# Altium schematic sheet RAM.schdoc
size 272 x 191 mm
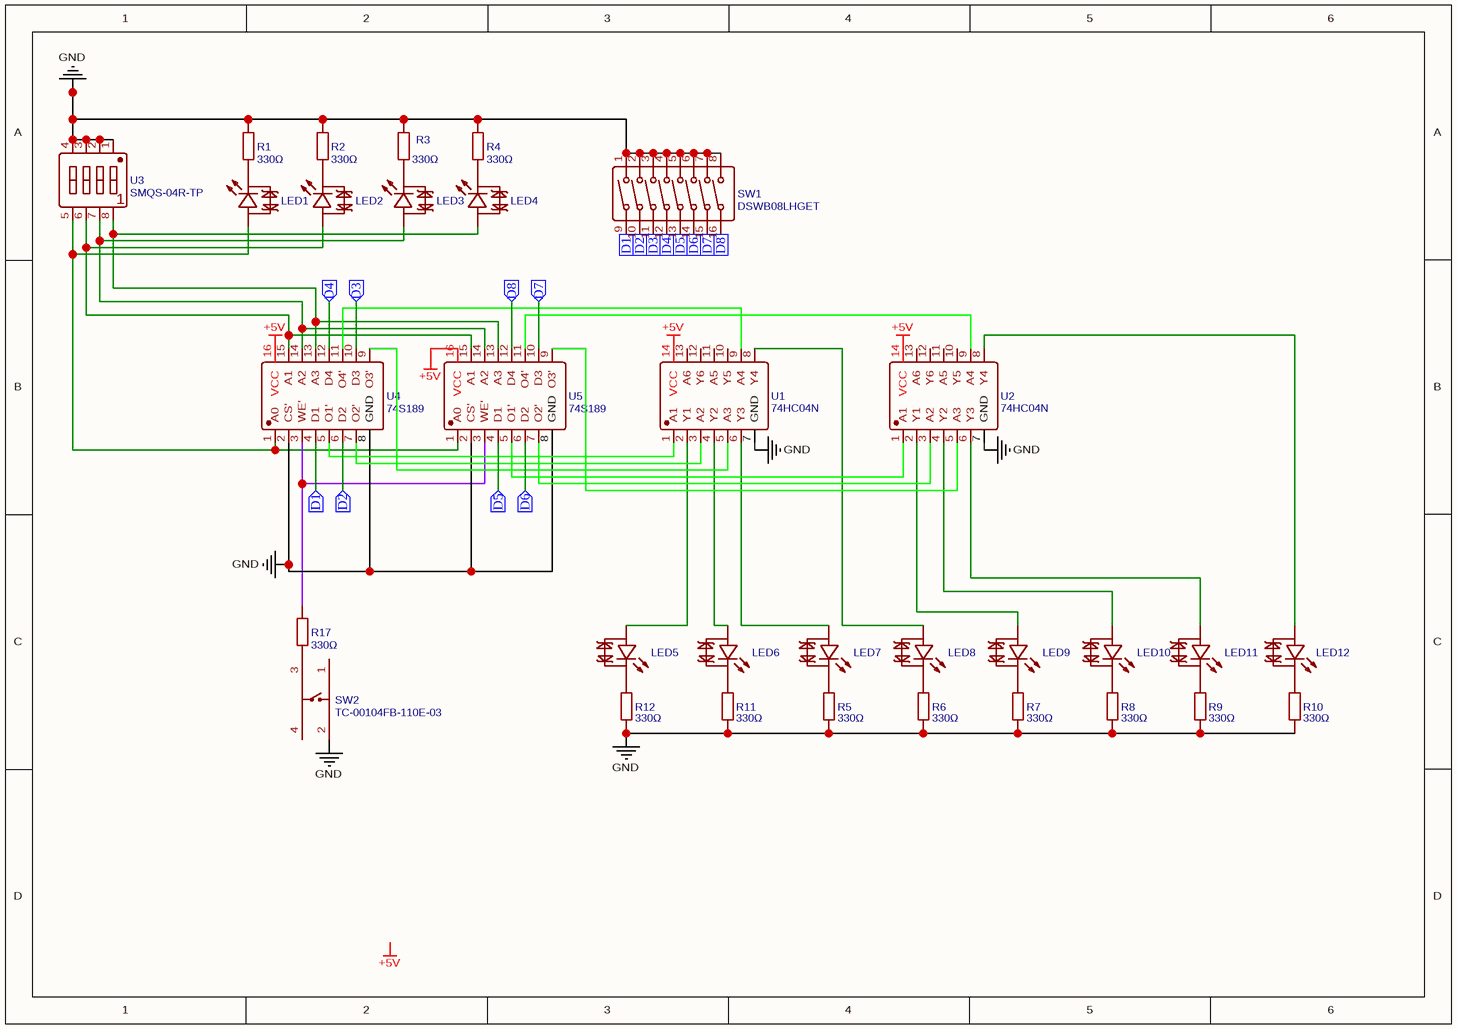
[diagram p0: RAM.schdoc]

## Parts
LED1  204-15UTC/S400-X9-L  [LED-TH_BD3.0-P2.54-FD]  (value not drawn)
LED2  204-15UTC/S400-X9-L  [LED-TH_BD3.0-P2.54-FD]  (value not drawn)
LED3  204-15UTC/S400-X9-L  [LED-TH_BD3.0-P2.54-FD]  (value not drawn)
LED4  204-15UTC/S400-X9-L  [LED-TH_BD3.0-P2.54-FD]  (value not drawn)
LED5  204-15UTC/S400-X9-L  [LED-TH_BD3.0-P2.54-FD]  (value not drawn)
LED6  204-15UTC/S400-X9-L  [LED-TH_BD3.0-P2.54-FD]  (value not drawn)
LED7  204-15UTC/S400-X9-L  [LED-TH_BD3.0-P2.54-FD]  (value not drawn)
LED8  204-15UTC/S400-X9-L  [LED-TH_BD3.0-P2.54-FD]  (value not drawn)
LED9  204-15UTC/S400-X9-L  [LED-TH_BD3.0-P2.54-FD]  (value not drawn)
LED10  204-15UTC/S400-X9-L  [LED-TH_BD3.0-P2.54-FD]  (value not drawn)
LED11  204-15UTC/S400-X9-L  [LED-TH_BD3.0-P2.54-FD]  (value not drawn)
LED12  204-15UTC/S400-X9-L  [LED-TH_BD3.0-P2.54-FD]  (value not drawn)
R1  330Ω  [RES-TH_BD3.3-L9.0-P13.00-D0.6]
R2  330Ω  [RES-TH_BD3.3-L9.0-P13.00-D0.6]
R3  330Ω  [RES-TH_BD3.3-L9.0-P13.00-D0.6]
R4  330Ω  [RES-TH_BD3.3-L9.0-P13.00-D0.6]
R5  330Ω  [RES-TH_BD3.3-L9.0-P13.00-D0.6]
R6  330Ω  [RES-TH_BD3.3-L9.0-P13.00-D0.6]
R7  330Ω  [RES-TH_BD3.3-L9.0-P13.00-D0.6]
R8  330Ω  [RES-TH_BD3.3-L9.0-P13.00-D0.6]
R9  330Ω  [RES-TH_BD3.3-L9.0-P13.00-D0.6]
R10  330Ω  [RES-TH_BD3.3-L9.0-P13.00-D0.6]
R11  330Ω  [RES-TH_BD3.3-L9.0-P13.00-D0.6]
R12  330Ω  [RES-TH_BD3.3-L9.0-P13.00-D0.6]
R17  330Ω  [RES-TH_BD3.3-L9.0-P13.00-D0.6]
SW1  DSWB08LHGET  [SW-TH_DSWB08LHGET]
SW2  TC-00104FB-110E-03  [SW-TH_4P-L6.0-W6.0-P4.50-LS6.5]
U1  74HC04N  [DIP-14_L19.4-W6.4-P2.54-LS7.6-BL]
U2  74HC04N  [DIP-14_L19.4-W6.4-P2.54-LS7.6-BL]
U3  SMQS-04R-TP  [SW-TH_8P-P2.54_SMQS-04R-TP]
U4  74S189  [SOP-8]
U5  74S189  [SOP-8]

## Ports
D1 (in), D2 (in), D3 (in), D4 (in), D5 (in), D6 (in), D7 (in), D8 (in)

## Nets
+5V: U1.14(VCC) U2.14(VCC) U4.16(VCC) U5.16(VCC)
GND: R1.2 R2.2 R3.2 R4.2 R5.2 R6.2 R7.2 R8.2 R9.2 R10.2 R11.2 R12.2 SW1.1 SW1.2 SW1.3 SW1.4 SW1.5 SW1.6 SW1.7 SW1.8 SW2.2 U1.7(GND) U2.7(GND) U3.1(PIN1) U3.2(PIN2) U3.3(PIN3) U3.4(PIN4) U4.2(CS') U4.8(GND) U5.2(CS') U5.8(GND)
D1: SW1.9 U4.4(D1) ; port D1
D2: SW1.10 U4.6(D2) ; port D2
D3: SW1.11 U4.10(D3) ; port D3
D4: SW1.12 U4.12(D4) ; port D4
D5: SW1.13 U5.4(D1) ; port D5
D6: SW1.14 U5.6(D2) ; port D6
D7: SW1.15 U5.10(D3) ; port D7
D8: SW1.16 U5.12(D4) ; port D8
NetLED1_1: LED1.1(A) U3.5(PIN5) U4.1(A0) U5.1(A0)
NetLED1_2: LED1.2(C) R1.1
NetLED2_1: LED2.1(A) U3.6(PIN6) U4.15(A1) U5.15(A1)
NetLED2_2: LED2.2(C) R2.1
NetLED3_1: LED3.1(A) U3.7(PIN7) U4.14(A2) U5.14(A2)
NetLED3_2: LED3.2(C) R3.1
NetLED4_1: LED4.1(A) U3.8(PIN8) U4.13(A3) U5.13(A3)
NetLED4_2: LED4.2(C) R4.1
NetLED5_1: LED5.1(A) U1.2(Y1)
NetLED5_2: LED5.2(C) R12.1
NetLED6_1: LED6.1(A) U1.4(Y2)
NetLED6_2: LED6.2(C) R11.1
NetLED7_1: LED7.1(A) U1.6(Y3)
NetLED7_2: LED7.2(C) R5.1
NetLED8_1: LED8.1(A) U1.8(Y4)
NetLED8_2: LED8.2(C) R6.1
NetLED9_1: LED9.1(A) U2.2(Y1)
NetLED9_2: LED9.2(C) R7.1
NetLED10_1: LED10.1(A) U2.4(Y2)
NetLED10_2: LED10.2(C) R8.1
NetLED11_1: LED11.1(A) U2.6(Y3)
NetLED11_2: LED11.2(C) R9.1
NetLED12_1: LED12.1(A) U2.8(Y4)
NetLED12_2: LED12.2(C) R10.1
NetR17_1: R17.1 U4.3(WE') U5.3(WE')
NetR17_2: R17.2 SW2.3
NetU1_1: U1.1(A1) U4.5(O1')
NetU1_3: U1.3(A2) U4.7(O2')
NetU1_5: U1.5(A3) U4.9(O3')
NetU1_9: U1.9(A4) U4.11(O4')
NetU2_1: U2.1(A1) U5.5(O1')
NetU2_3: U2.3(A2) U5.7(O2')
NetU2_5: U2.5(A3) U5.9(O3')
NetU2_9: U2.9(A4) U5.11(O4')

Not connected (* = marked no-connect by the designer): SW2 1 4; U1 10(Y5) 11(A5) 12(Y6) 13(A6); U2 10(Y5) 11(A5) 12(Y6) 13(A6)

## Notes on the sheet
- Labels drawn without touching a wire or pin: +5V

## Library data of the parts
LED1-LED12 = 204-15UTC/S400-X9-L: Manufacturer: EVERLIGHT(亿光); Contributor: LCSC; Supplier: LCSC; Supplier Part: C282138; Manufacturer Part: 204-15UTC/S400-X9-L; JLCPCB Part Class: Extended Part; spicePre: L; spiceSymbolName: 204-15UTC/S400-X9-L
R1-R12 R17 = 330Ω: Manufacturer: CCO(千志电子); Manufacturer Part: MF1/2W-0.1Ω±1% T; nameAlias: Value; Contributor: LCSC; Supplier: LCSC; Supplier Part: C119393; JLCPCB Part Class: Extended Part; spicePre: R; spiceSymbolName: MF1/2W-0.1Ω±1% T52
SW1 = DSWB08LHGET: Manufacturer: YE; Contributor: LCSC; Supplier: LCSC; Supplier Part: C99413; Manufacturer Part: DSWB08LHGET; JLCPCB Part Class: Extended Part; spicePre: S; spiceSymbolName: DSWB08LHGET
SW2 = TC-00104FB-110E-03: Manufacturer: HOOYA(皓宇电子); Contributor: lcsc; Supplier: LCSC; Supplier Part: C7542981; Manufacturer Part: TC-00104FB-110E-03; JLCPCB Part Class: Extended Part; spicePre: S; spiceSymbolName: TC-00104FB-110E-03
U1 U2 = 74HC04N: Manufacturer: HGSEMI(华冠); Contributor: LCSC; Supplier: LCSC; Supplier Part: C507192; Manufacturer Part: 74HC04N; JLCPCB Part Class: Extended Part; spicePre: U; spiceSymbolName: 74HC04N
U3 = SMQS-04R-TP: Manufacturer: SM Switch; Contributor: lcsc; Supplier: LCSC; Supplier Part: C5299505; Manufacturer Part: SMQS-04R-TP; JLCPCB Part Class: Extended Part; spicePre: U; spiceSymbolName: SMQS-04R-TP
U4 U5 = 74S189: Contributor: madhumathi.it22; spicePre: U; spiceSymbolName: 74S189